# Altium schematic sheet DCDC_DDS.SchDoc
size 420 x 297 mm; Address1: Address1; Address2: Address2; Address3: Address3; Address4: Address4; SheetNumber: 1; Scale: 1:1; Разраб.: Иванов; Обозначение документа: АБВГ.123456.001 Э3; Пров.: Петров; Утв.: Сидоров; Наименование организации: ОАО "Концерн "МПО-Гидроприбор"; Перв. применение: АБВГ.123456.000; Наименование изделия 1: Плата; Наименование изделия 2: Схема электрическая; Наименование изделия 3: принципиальная; Нач. отд.: Нач. отд.; Фамилия нач. отд.: Сидоров
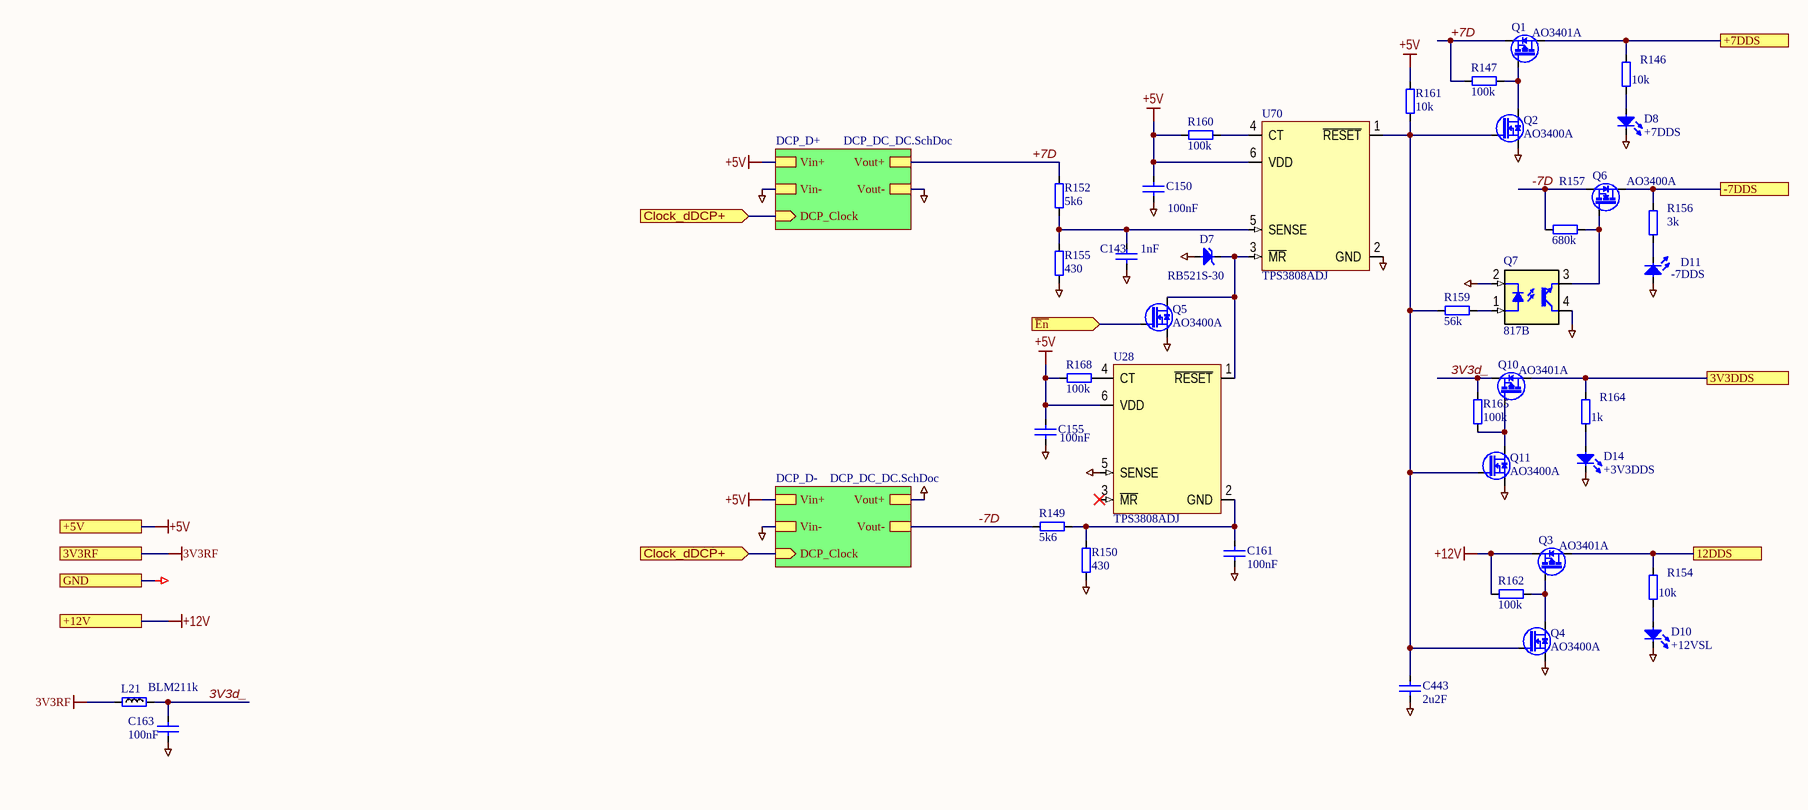
[diagram p0: DCDC_DDS.SchDoc]

## Parts
C143  1nF  [SMD0805CAP]
C150  100nF  [SMD0805CAP]
C155  100nF  [SMD0805CAP]
C161  100nF  [SMD0805CAP]
C163  100nF  [SMD0805CAP]
C443  2u2F  [SMD0805CAP]
D7  RB521S-30  [SODFL1608X65N]
D8  +7DDS  [LED0603]
D10  +12VSL  [LED0603]
D11  -7DDS  [LED0603]
D14  +3V3DDS  [LED0603]
L21  BLM211k  [RESC2012X50N]
Q1  AO3401A  [SOT95P229X119-3N]
Q2  AO3400A  [SOT95P229X119-3N]
Q3  AO3401A  [SOT95P229X119-3N]
Q4  AO3400A  [SOT95P229X119-3N]
Q5  AO3400A  [SOT95P229X119-3N]
Q6  AO3400A  [SOT95P229X119-3N]
Q7  817B  [DIP4-300]
Q10  AO3401A  [SOT95P229X119-3N]
Q11  AO3400A  [SOT95P229X119-3N]
R146  10k  [SMD0805RES]
R147  100k  [SMD0805RES]
R149  5k6  [SMD0805RES]
R150  430  [SMD0805RES]
R152  5k6  [SMD0805RES]
R154  10k  [SMD0805RES]
R155  430  [SMD0805RES]
R156  3k  [SMD0805RES]
R157  680k  [SMD0805RES]
R159  56k  [SMD0805RES]
R160  100k  [SMD0805RES]
R161  10k  [SMD0805RES]
R162  100k  [SMD0805RES]
R164  1k  [SMD0805RES]
R165  100k  [SMD0805RES]
R168  100k  [SMD0805RES]
U28  TPS3808ADJ  [SOT95P270X145-6N]
U70  TPS3808ADJ  [SOT95P270X145-6N]

## Sub-sheets
DCP_D+ = DCP_DC_DC.SchDoc: DCP_Clock (in), Vout+, Vout-, Vin-, Vin+
DCP_D- = DCP_DC_DC.SchDoc: DCP_Clock (in), Vout+, Vout-, Vin-, Vin+

## Ports
3V3DDS, 3V3RF, 12DDS, +5V, +7DDS, +12V, -7DDS, Clock_dDCP+ (in), GND, ~{En} (in)

## Nets
3V3RF: L21.2 ; port 3V3RF
+5V: C150.2 C155.2 R160.1 R161.1 R168.1 U28.6(VDD) U70.6(VDD) ; port +5V, sheet DCP_D+/Vin+, sheet DCP_D-/Vin+
+12V: Q3.2(S) R162.2 ; port +12V
GND: C143.1 C150.1 C155.1 C161.2 C163.1 C443.2 D7.2(A) D8.1(C) D10.1(C) D11.2(A) D14.1(C) Q2.2(S) Q4.2(S) Q5.2(S) Q7.2(C) Q7.4(C) Q11.2(S) R150.1 R155.1 U28.5(SENSE) U70.2(GND) ; port GND, sheet DCP_D+/Vout-, sheet DCP_D+/Vin-, sheet DCP_D-/Vout+, sheet DCP_D-/Vin-
3V3d_: C163.2 L21.1 Q10.2(S) R165.1
3V3DDS: Q10.3(D) R164.2 ; port 3V3DDS
12DDS: Q3.3(D) R154.2 ; port 12DDS
+7D: Q1.2(S) R147.2 R152.1 ; sheet DCP_D+/Vout+
+7DDS: Q1.3(D) R146.2 ; port +7DDS
-7D: Q6.2(S) R149.1 R157.2 ; sheet DCP_D-/Vout-
-7DDS: Q6.3(D) R156.2 ; port -7DDS
~{En}: Q5.1(G) ; port ~{En}
Clock_dDCP+: port Clock_dDCP+, sheet DCP_D+/DCP_Clock, sheet DCP_D-/DCP_Clock
NetC143_2: C143.2 R152.2 R155.2 U70.5(SENSE)
NetC161_1: C161.1 R149.2 R150.2 U28.2(GND)
NetC443_1: C443.1 Q2.1(G) Q4.1(G) Q11.1(G) R159.1 R161.2 U70.1(~{RESET})
NetD7_1: D7.1(C) Q5.3(D) U28.1(~{RESET}) U70.3(~{MR})
NetD8_2: D8.2(A) R146.1
NetD10_2: D10.2(A) R154.1
NetD11_1: D11.1(C) R156.1
NetD14_2: D14.2(A) R164.1
NetQ1_1: Q1.1(G) Q2.3(D) R147.1
NetQ3_1: Q3.1(G) Q4.3(D) R162.1
NetQ6_1: Q6.1(G) Q7.3(E) R157.1
NetQ7_1: Q7.1(A) R159.2
NetQ10_1: Q10.1(G) Q11.3(D) R165.2
NetR160_2: R160.2 U70.4(CT)
NetR168_2: R168.2 U28.4(CT)

Not connected (* = marked no-connect by the designer): U28 3(~{MR})*

## Notes on the sheet
- Подп. и дата
- Инв. № дубл.
- Взам. инв. №
- Инв. № подл.
- Изм.
- Лист
- № докум.
- Подп.
- Дата
- Копировал
- Формат А3

## Library data of the parts
C143 C150 C155 C161 C163 C443 = C0805: Чип конденсатор 0805; Voltage: 25V; Vendor: Vishay; DielectricType: X5R; SMD Solders: 2; Solder Option: RM; Tolerance: 20%; Pkg: SMD0805; Device: Cap0805; Price: 2
  C143: Value: 1nF
  C150 C155 C161 C163: Value: 100nF
  C443: Value: 2u2F
D7 = RB521S-30: Чип Шоттки диод; Vendor: CTK; Voltage: 30V; SMD Solders: 2; Solder Option: RM; Pkg: SOD523; Price: 5; Device: RB521S-30; Name to order: RB521S-30
D8 D10 D11 D14 = LED0603: Чип светодиод 0603; Vendor: KB; SMD Solders: 2; Solder Option: RM; Pkg: SMD0603; Price: 10; Device: LED0603
  D8: Value: +7DDS
  D10: Value: +12VSL
  D11: Value: -7DDS
  D14: Value: +3V3DDS
L21 = BLM21: SMD Ferrite bead 0805; Vendor: Vishay; Value: 1k; Pkg: SMD0805; SMD Solders: 2; Solder Option: RM; Price: 10; Device: BLM21
Q1 Q3 Q10 = AO3401A: PMOS; Vendor: UMW; Pkg: SOT23; SMD Solders: 3; Solder Option: RM; THD Solders: 0; Voltage: -30V; Price: 10; Device: AO3401A; Name to order: AO3401A
Q2 Q4-Q6 Q11 = AO3400A: NMOS; Vendor: UMW; Pkg: SOT23; SMD Solders: 3; Solder Option: RM; Voltage: 30V; Price: 10; Device: AO3400A; Name to order: AO3400A
Q7 = 817B: Optotransistor; Pkg: DIP4; SMD Solders: 0; Solder Option: RM; THD Solders: 4; Vendor: UMW; Voltage: 35V; Device: 817B; Price: 10; Name to order: 817B; Current: 0
R146 R147 R149 R150 R152 R154-R157 R159-R162 R164 R165 R168 = R0805: Чип резистор 0805; Vendor: Vishay; SMD Solders: 2; Solder Option: RM; TC: 100ppm/C; Tolerance: 1%; Pkg: SMD0805; Pwr: 125mW; Device: Res0805; Price: 2
  R146 R154 R161: Value: 10k
  R147 R160 R162 R165 R168: Value: 100k
  R149 R152: Value: 5k6
  R150 R155: Value: 430
  R156: Value: 3k
  R157: Value: 680k
  R159: Value: 56k
  R164: Value: 1k
U28 U70 = TPS3808: Supervisory Circuit. Low-Quiescent-Current, Programmable-Delay; Vendor: Texas Instruments; Value: ADJ; Pkg: SOT23-6; SMD Solders: 6; Solder Option: RM; THD Solders: 0; Name to order: TPS3808G01DBV; Current: 6uA; thVoltage: 400mV; Price: 200; Device: TPS3808